# Altium schematic sheet 水位控制系统-检测端.SchDoc
size A4
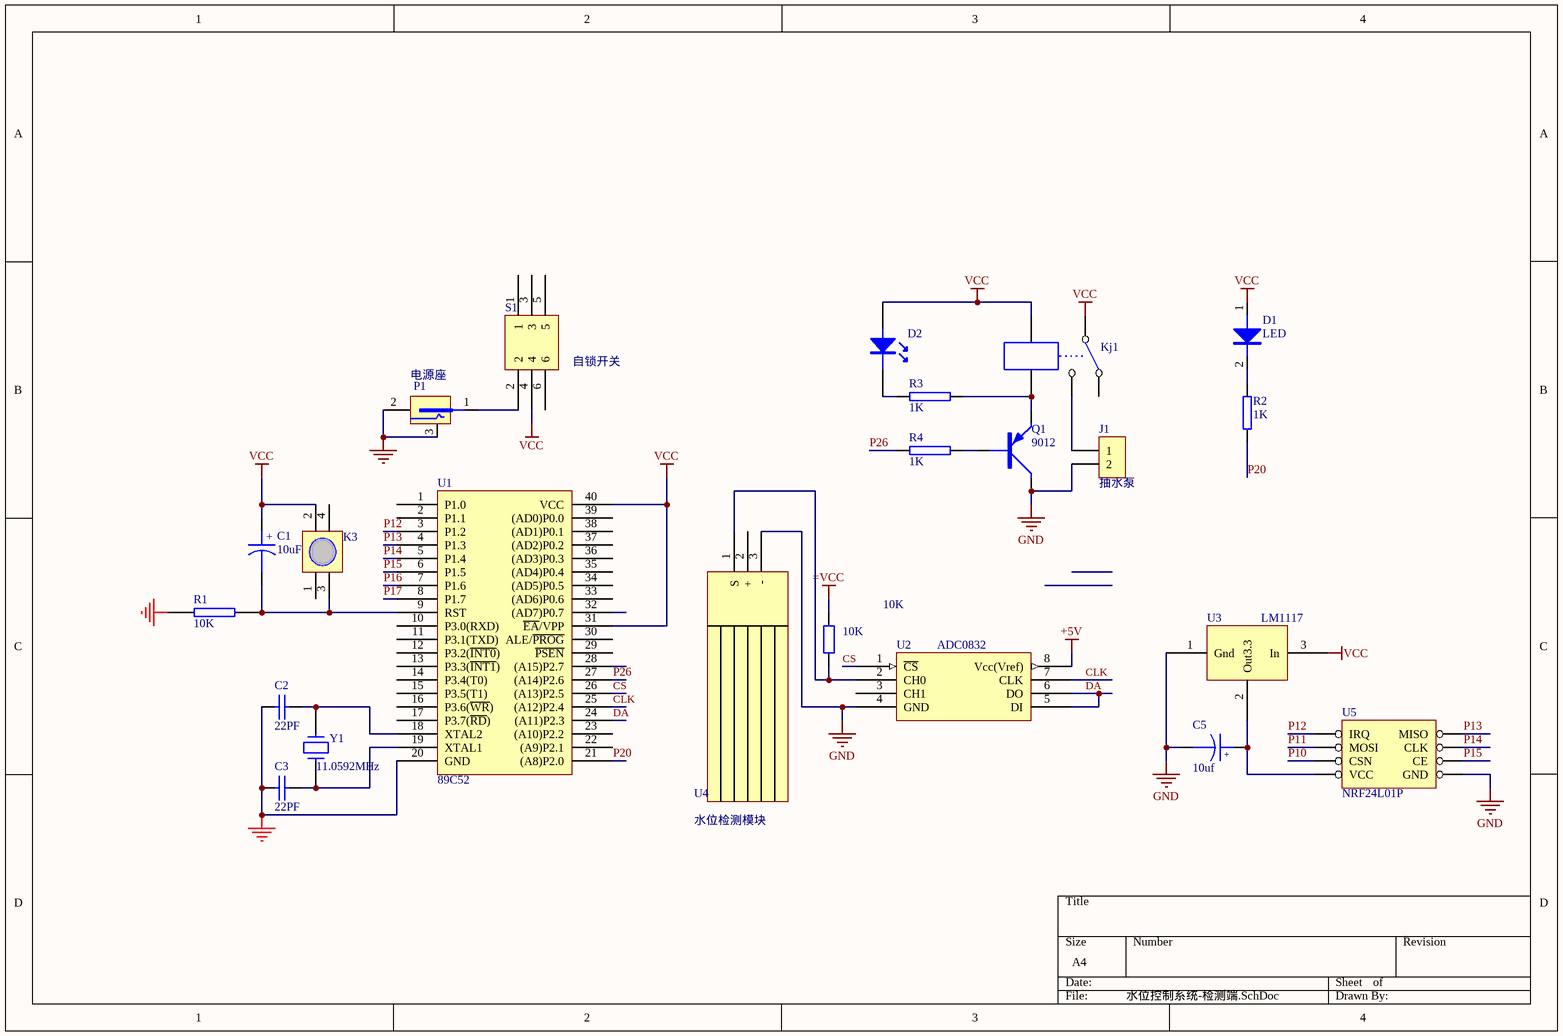
[diagram p0: 水位控制系统-检测端.SchDoc]

## Parts
?  10K  [AXIAL-0.4]
C1  10uF  [C100]
C2  22PF  [C01]
C3  22PF  [C01]
C5  10uf  [C4*7]
D1  LED  [LED-5MM]
D2  (no value)  [LED5]
J1  抽水泵  [2P]
K3  (no value)  [KEY]
Kj1  (no value)  [21F]
P1  电源座  [DC2.1]
Q1  9012  [9014]
R1  10K  [R-DIP]
R2  1K  [电阻]
R3  1K  [1/4W]
R4  1K  [1/4W]
S1  自锁开关  [SW6]
U1  89C52  [DIP40]
U2  ADC0832
U3  LM1117  [SOT-223 - 3]
U4  水位检测模块
U5  NRF24L01P  [2401]
Y1  11.0592MHz  [JZ]

## Nets
+5V: U2.8(Vcc(Vref))
=VCC: ?.2
GND: C2.2 C3.2 C5.1 J1.2 P1.2 P1.3 Q1.3(C) R1.1 U1.20(GND) U2.4(GND) U3.1(Gnd) U4.3(-) U5.1(GND)
VCC: C1.1 D1.1 D2.A K3.2 Kj1.1 Kj1.4 S1.4 U1.31(~{EA}/VPP) U1.40(VCC) U3.3(In)
CLK: U1.25((A12)P2.4) U2.7(CLK)
CS: U1.26((A13)P2.5) U2.1(~{CS})
DA: U1.24((A11)P2.3) U2.5(DI) U2.6(DO)
P10: U5.4(CSN)
P11: U5.6(MOSI)
P12: U1.3(P1.2) U5.8(IRQ)
P13: U1.4(P1.3) U5.7(MISO)
P14: U1.5(P1.4) U5.5(CLK)
P15: U1.6(P1.5) U5.3(CE)
P16: U1.7(P1.6)
P17: U1.8(P1.7)
P20: R2.1 U1.21((A8)P2.0)
P26: R4.1 U1.27((A14)P2.6)
Net?_1: ?.1 U2.2(CH0) U4.1(S)
NetC1_2: C1.2 K3.3 R1.2 U1.9(RST)
NetC2_1: C2.1 U1.18(XTAL2) Y1.1
NetC3_1: C3.1 U1.19(XTAL1) Y1.2
NetC5_2: C5.2 U3.2(Out3.3) U5.2(VCC)
NetD1_2: D1.2 R2.2
NetD2_K: D2.K R3.1
NetJ1_1: J1.1 Kj1.3
NetKj1_5: Kj1.5 Q1.2(E) R3.2
NetP1_1: P1.1 S1.2
NetQ1_1: Q1.1(B) R4.2

Not connected (* = marked no-connect by the designer): K3 1 4; Kj1 2; S1 1 3 5 6; U1 1(P1.0) 2(P1.1) 10(P3.0(RXD)) 11(P3.1(TXD)) 12(P3.2(~{INT0})) 13(P3.3(~{INT1})) 14(P3.4(T0)) 15(P3.5(T1)) 16(P3.6(~{WR})) 17(P3.7(~{RD})) 22((A9)P2.1) 23((A10)P2.2) 28((A15)P2.7) 29(~{PSEN}) 30(ALE/~{PROG}) 32((AD7)P0.7) 33((AD6)P0.6) 34((AD5)P0.5) 35((AD4)P0.4) 36((AD3)P0.3) 37((AD2)P0.2) 38((AD1)P0.1) 39((AD0)P0.0); U2 3(CH1); U4 2(+)

## Notes on the sheet
- (in symbol CAPACITOR POL) +
- (in symbol 电解电容) +

## Library data of the parts
? = Res2: Resistor; Published: 8-Jun-2000; LatestRevisionDate: 17-Jul-2002; LatestRevisionNote: Re-released for DXP Platform.; PackageReference: AXIAL-0.4; Publisher: Altium Limited; Value: 10K
C1 = CAPACITOR POL: Capacitor
C2 C3 = CAP: Capacitor
C5 = 电解电容: Capacitor
D1 = LED-5MM
D2 = LED
J1 = CON2: Connector
K3 = KEY
Kj1 = RELAY-SPDT
P1 = POWER
Q1 = PNP2: PNP Transistor
R1 R3 R4 = RES2
R2 = 电阻-定值
S1 = SWITCH
U1 = AT89C51
U4 = Component_1
Y1 = CRYSTAL